# Altium schematic sheet Connectors.SchDoc: Connectors
size A3; Author: Borja Serra; CompanyName: Blueye Robotics; Organization: Blueye Robotics AS; Address1: Transittgata 10; Address2: 7042 Trondheim; Address3: Norway; Revision: 0; SheetNumber: 3; SheetTotal: 3
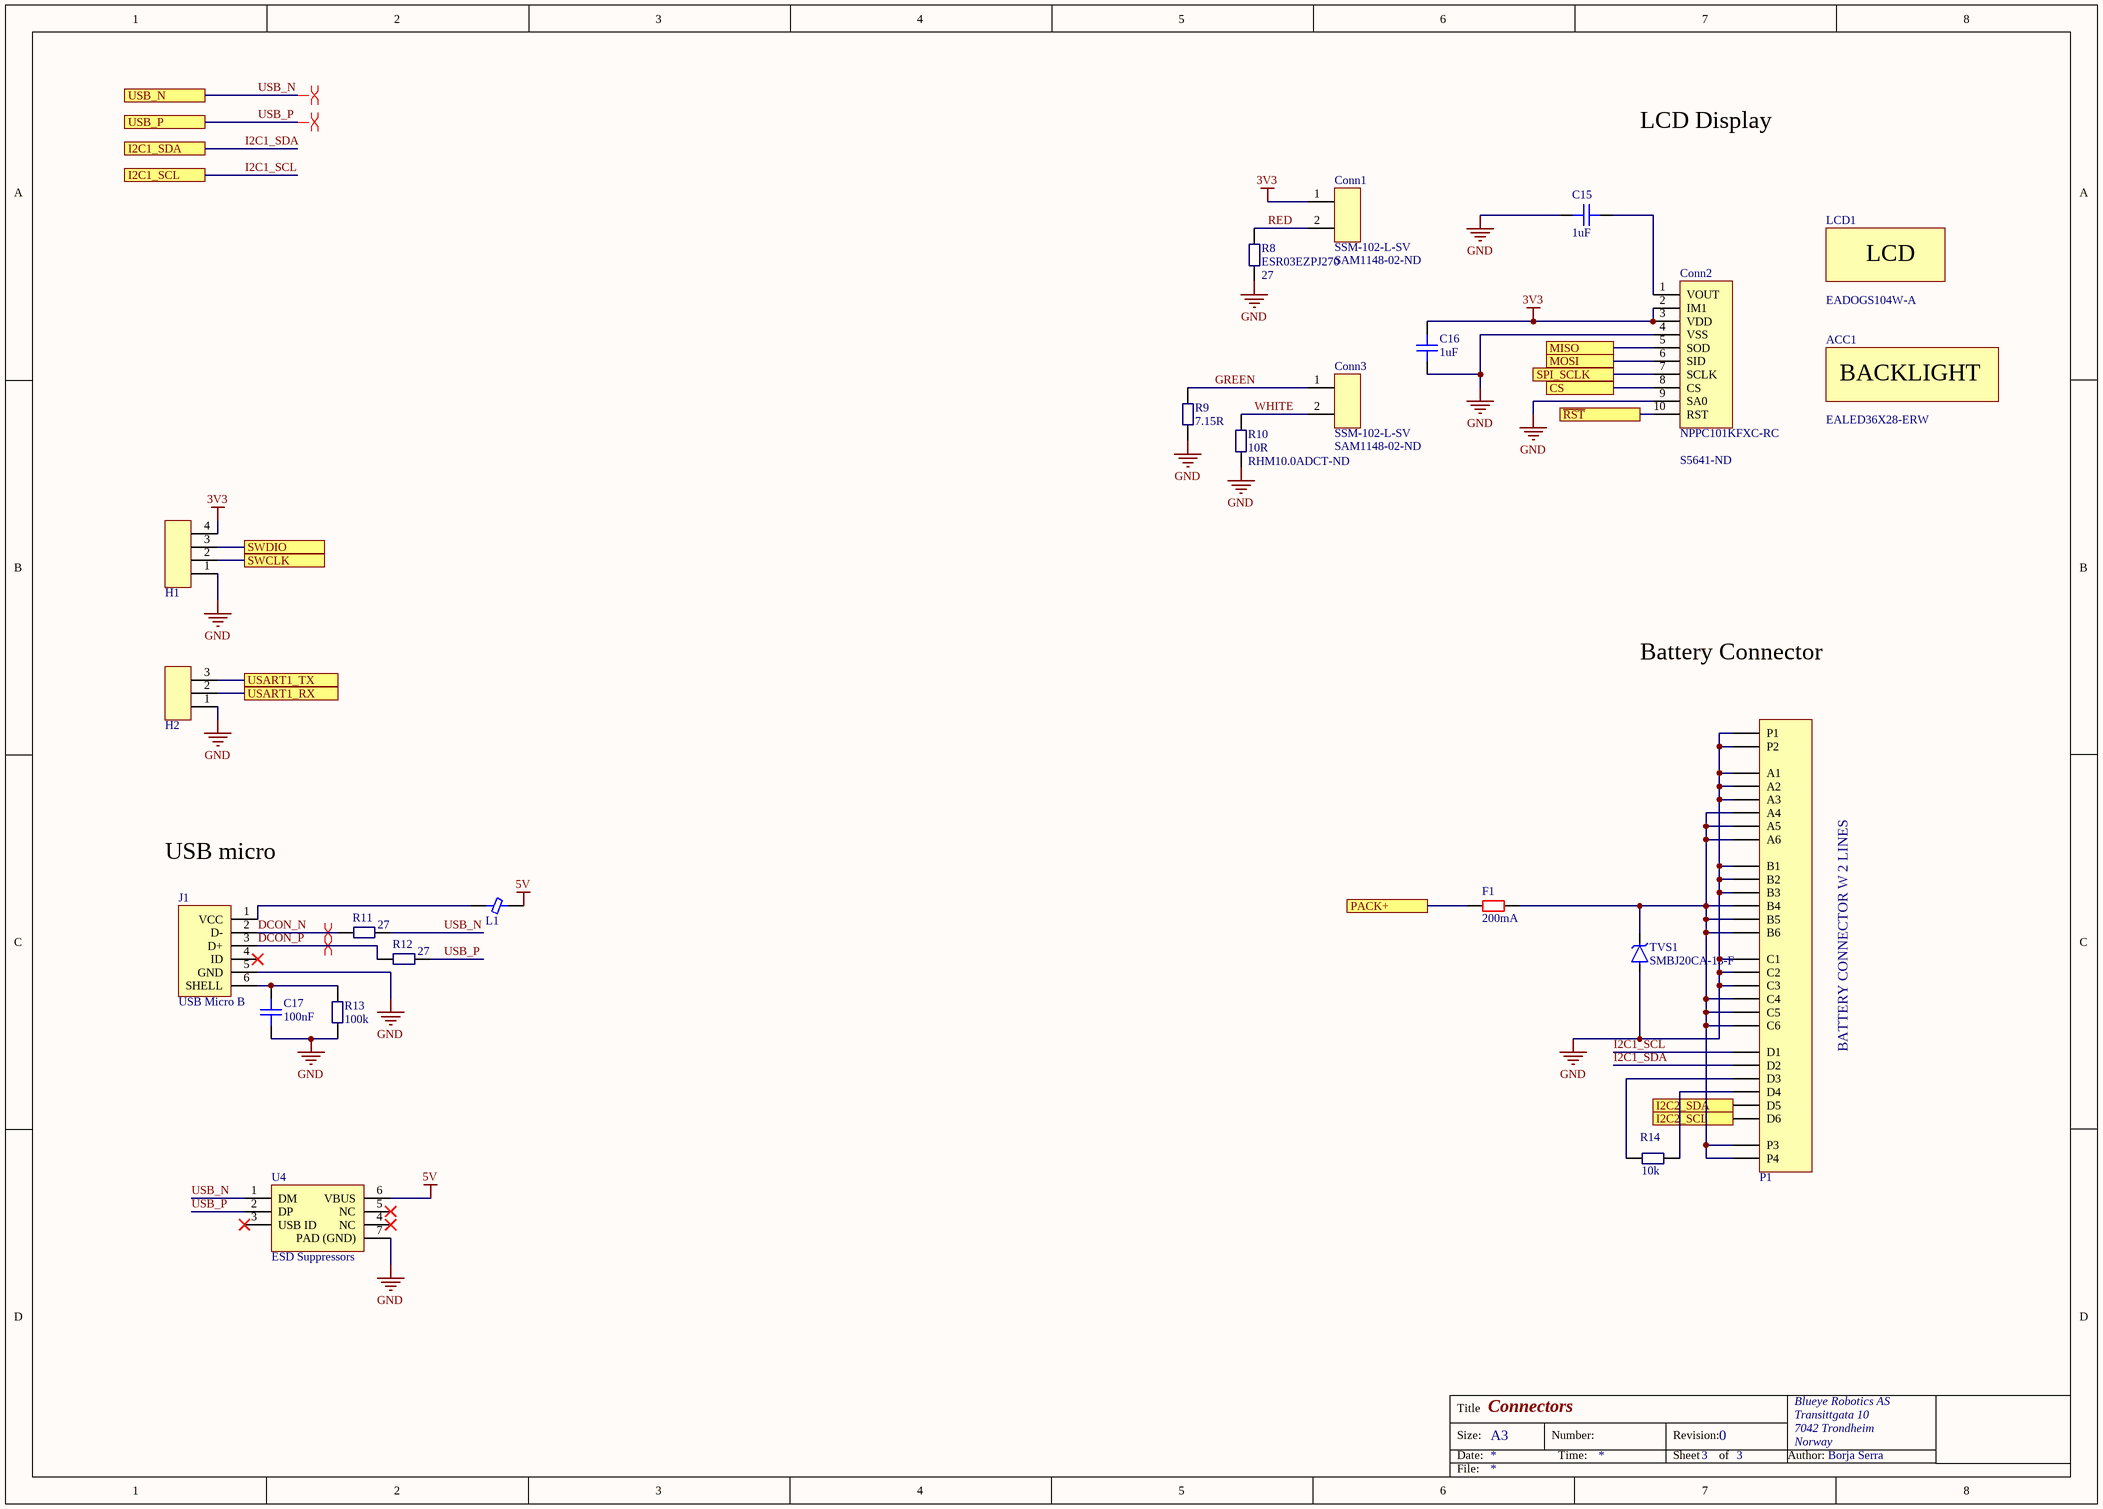
[diagram p0: Connectors.SchDoc]

## Parts
ACC1  Manufacturer Part Number 1: EALED36X28-ERW  (graphical)
C15  1uF  [1206 CAPACITOR]
C16  1uF  [1206 CAPACITOR]
C17  100nF  [0603 Capacitor]  (no BOM)
Conn1  SSM-102-L-SV  Supplier Part Number 1: SAM1148-02-ND  [CON2_1X2_DU_SSM]
Conn2  NPPC101KFXC-RC  Supplier Part Number 1: S5641-ND  [CONN FMALE 10POS .1" SMD GOLD]
Conn3  SSM-102-L-SV  Supplier Part Number 1: SAM1148-02-ND  [CON2_1X2_DU_SSM]
F1  200mA  [0603 Resistor]
H1  Header 4pin SMD  [Header 4pos 100 mil SMD]  (value not drawn)
H2  Header 3pin SMD  [Header 3pos 100 mil SMD]  (value not drawn)
J1  USB Micro B  [10118193-0001LF Micro USB]
L1  60 OHM  [0805 Capacitor]  (value not drawn)
LCD1  Manufacturer Part Number 1: EADOGS104W-A  (graphical)
P1  MPTC-02-24-02-6.30-XX-X-V-LC  [MPTC-02-24-02-6.30-XX-X-V-LC]  (value not drawn)
R8  ESR03EZPJ270  value 27  [0603 Resistor]
R9  Resistance: 7.15R  [0603 Resistor]  (hidden comment: CRCW06037R15FKEA)
R10  10R  Supplier Part Number 1: RHM10.0ADCT-ND  [0603 Resistor]
R11  value 27  [0603 Resistor]  (hidden comment: ESR03EZPJ270)
R12  value 27  [0603 Resistor]  (hidden comment: ESR03EZPJ270)
R13  100k  [0603 Resistor]  (no BOM)
R14  10k  [0603 Resistor]
TVS1  SMBJ20CA-13-F  [TVS diode]
U4  ESD Suppressors  [RCLAMP0854P.TCT - SON50P160X65_HS-7N]

## Ports
CS, I2C1_SCL, I2C1_SDA, I2C2_SCL, I2C2_SDA, MISO, MOSI, PACK+, SPI_SCLK, SWCLK, SWDIO, USART1_RX, USART1_TX, USB_N, USB_P, ~{RST}

## Nets
3V3: C16.1 Conn1.1 Conn2.2(IM1) Conn2.3(VDD) H1.4
5V: L1.2(L2) U4.6(VBUS)
GND: C15.2 C16.2 C17.1 Conn2.4(VSS) Conn2.9(SA0) H1.1 H2.1 J1.5(GND) P1.A1 P1.A2 P1.A3 P1.B1 P1.B2 P1.B3 P1.C1 P1.C2 P1.C3 P1.P1 P1.P2 R8.1 R9.1 R10.1 R13.1 TVS1.2 U4.7(PAD_(GND))
CS: Conn2.8(CS) ; port CS
DCON_N: J1.2(D-) R11.1
DCON_P: J1.3(D+) R12.1
GREEN: Conn3.1 R9.2
I2C1_SCL: P1.D1 ; port I2C1_SCL
I2C1_SDA: P1.D2 ; port I2C1_SDA
I2C2_SCL: P1.D6 ; port I2C2_SCL
I2C2_SDA: P1.D5 ; port I2C2_SDA
MISO: Conn2.5(SOD) ; port MISO
MOSI: Conn2.6(SID) ; port MOSI
PACK+: F1.1 ; port PACK+
~{RST}: Conn2.10(RST) ; port ~{RST}
RED: Conn1.2 R8.2
SPI_SCLK: Conn2.7(SCLK) ; port SPI_SCLK
SWCLK: H1.2 ; port SWCLK
SWDIO: H1.3 ; port SWDIO
USART1_RX: H2.2 ; port USART1_RX
USART1_TX: H2.3 ; port USART1_TX
USB_N: R11.2 U4.1(DM) ; port USB_N
USB_P: R12.2 U4.2(DP) ; port USB_P
WHITE: Conn3.2 R10.2
NetC15_1: C15.1 Conn2.1(VOUT)
NetC17_2: C17.2 J1.6(SHELL) R13.2
NetF1_2: F1.2 P1.A4 P1.A5 P1.A6 P1.B4 P1.B5 P1.B6 P1.C4 P1.C5 P1.C6 P1.P3 P1.P4 TVS1.1
NetJ1_1: J1.1(VCC) L1.1(L1)
NetP1_D3: P1.D3 R14.1
NetP1_D4: P1.D4 R14.2

Not connected (* = marked no-connect by the designer): J1 4(ID)*; U4 3(USB_ID)* 4(NC)* 5(NC)*

## Layout directives
differential pair: DCON_N, DCON_P, USB_N, USB_P

## Notes on the sheet
- LCD Display
- Battery Connector
- (near J1) USB micro
- BATTERY CONNECTOR W 2 LINES
- Title
- Size:
- Date:
- A3
- Number:
- Time:
- Revision:
- Sheet
- of
- Author:
- File:
- (in symbol 4X10 DOG CHARACTERDISPLAY) LCD
- (in symbol LED BACKLIT F. EA DOGS104) BACKLIGHT

## Library data of the parts
ACC1 = LED BACKLIT F. EA DOGS104: Manufacturer 1: Electronic Assembly; Supplier 1: Digi-Key; Stock 1: 9; Pricing 1: 1=14.66, 10=14.04, 25=10.92, 100=9.36, 250=8.892, 500=8.424, 1000=7.956 (USD); ComponentLink1URL: http://www.mouser.com/ds/2/127/dogs104e-553061.pdf; ComponentLink1Description: http://www.mouser.com/ds/2/127/dogs104e-553061.pdf; Supplier Part Number 1: 1481-1235-ND
C15 C16 = Capacitor 1uF 50V: Multilayer Ceramic Capacitors MLCC - SMD/SMT 1206 1.0uF 50V X7R 20%; Manufacturer: TDK; MPN: C3216X7R1H105M160AB; SPN: 810-C3216X7R1H105M; Supplier: Mouser
C17 = CAP CER 0.1UF 50V X7R 0603: MPN: CL10B104KB8NNNC; Manufacturer: Samsung Electro-Mechanics; value: 100nF; Supplier 1: Digi-Key; Supplier Part Number 1: 1276-1000-1-ND
Conn1 Conn3 = CONN RCPT .100" 2POS SNGL VERT: Manufacturer 1: Samtec; Description 1: SAMTEC         SSM-102-L-SV             Board-To-Board Connector, Vertical, SSM Series, 2 Contacts, Receptacle, 2.54 mm, Surface Mount; Contact Resistance: 10mR; Max Current Rating: 6.9A; Number of Positions: 2; Gender: Receptacle; Connector Type: Receptacle,Socket; Pitch: 2.54mm; Max Voltage Rating (AC): 475V; MPN: SSM-102-L-SV; Supplier 1: Digi-Key; Manufacturer Part Number 1: SSM-102-L-SV; Stock 1: 339; Pricing 1: 1=2.18, 10=1.953, 100=1.6081, 500=1.2711, 1000=1.0912, 5000=0.9955, 10000=0.9572 (USD); Mount: Surface Mount; Colour: Black; Housing Colour: Black; Housing Material: Polymer; Contact Plating: Nickel,Gold; Contact Material: Bronze; Min Operating Temperature: -55°C; Max Operating Temperature: 125°C; Number of Rows: 1; Packaging: Bulk; Termination: Solder; Number of Contacts: 2; Orientation: Straight; Length: 5.08mm; Depth: 2.54mm; Radiation Hardening: No; ComponentLink1URL: https://datasheet.ciiva.com/25617/0900766b811594ab-25617394.pdf; ComponentLink1Description: https://datasheet.ciiva.com/25617/0900766b811594ab-25617394.pdf; ComponentLink2URL: https://datasheet.ciiva.com/746/ssm-1xx-xxx-xx-xx-xx-x-xx-xx-mkt-746741.pdf; ComponentLink2Description: https://datasheet.ciiva.com/746/ssm-1xx-xxx-xx-xx-xx-x-xx-xx-mkt-746741.pdf; ComponentLink3URL: https://datasheet.ciiva.com/22677/81944-22677814.pdf; ComponentLink3Description: https://datasheet.ciiva.com/22677/81944-22677814.pdf; Current Rating: 6.9A; Voltage Rating: 475V; Voltage Rating (AC): 475V; Lead Pitch: 2.54mm; Lead Free: Lead Free; REACH SVHC: No SVHC
Conn2 = CONN FMALE 10POS .1" SMD GOLD: Manufacturer 1: Sullins; Pitch: 0.1inch; Number of Positions: 10; Connector Type: Socket,Header; MPN: NPPC101KFXC-RC; Manufacturer: NPPC101KFXC-RC; Supplier 1: Digi-Key; Manufacturer Part Number 1: NPPC101KFXC-RC; Stock 1: 1156; Pricing 1: 1=1.32, 10=1.195, 100=1.0244, 500=0.8537, 1000=0.7317, 5000=0.7046 (USD); Contact Plating: Gold; Contact Material: Bronze; Housing Colour: Black; Housing Material: Nylon; Number of Rows: 1; Packaging: Bulk; Termination: Solder; Length: 25.4mm; Lead Free: Lead Free; ComponentLink1URL: https://datasheet.ciiva.com/745/npxcxx1kfxx-rc10487-d-745368.pdf; ComponentLink1Description: https://datasheet.ciiva.com/745/npxcxx1kfxx-rc10487-d-745368.pdf; Description 1: CONN FMALE 10POS .1" SMD GOLD; Mount: Surface Mount; Colour: Black; Package Quantity: 1; Height: 7.1mm; Width: 2.5mm
F1 = Fuse 200mA 0603: MPN: F0603G0R20FNTR; Manufacturer: AVX Corporation; SPN: 478-6874-1-ND; Supplier: Digi-Key
H1 = Header 4pin SMD: CONN HEADER 4POS VERT 2.54MM SMD; Manufacturer: Molex, LLC; MPN: 0878980426; SPN: WM8617-ND; Supplier: Digikey
H2 = Header 3pin SMD: 3 Positions Header, Breakaway Connector 0.100" (2.54mm) Surface Mount Tin; Manufacturer: Molex, LLC; MPN: 0878980306; SPN: WM9810-ND; Supplier: Digikey
J1 = USB Micro B: USB Connectors 5P MICRO USB TYPE B RECEPTACLE W/ PEGS; Manufacturer: Amphenol FCI; MPN: 10118193-0001LF; SPN: 649-10118193-0001LF; Supplier: Mouser
L1 = FERRITE BEAD 60 ohm: FERRITE BEAD 60 OHM 0805 1LN; Manufacturer: Taiyo Yuden; MPN: BKP2125HS600-T; SPN: 587-1932-1-ND; Supplier: Digikey
LCD1 = 4X10 DOG CHARACTERDISPLAY: Manufacturer 1: Electronic Assembly; Supplier 1: Mouser; Stock 1: 0; Pricing 1: 1=16.68, 10=15.97, 50=12.42, 100=10.64, 1000=9.58, 10000=9.58 (USD); ComponentLink1URL: http://www.mouser.com/ds/2/127/dogs104e-553061.pdf; ComponentLink1Description: http://www.mouser.com/ds/2/127/dogs104e-553061.pdf; Supplier Part Number 1: 790-EADOGS104W-A
P1 = MPTC-02-24-02-6.30-XX-X-V-LC: Samtec PowerStrip 30A Signal/Power Combo Connector; MPN: MPTC-02-24-02-6.30-01-L-V; Manufacturer: Samtec
R8 R11 R12 = RES SMD 27 OHM 5% 1/4W 0603: Manufacturer 1: Rohm; Resistance: 27R; Max Power Dissipation: 250mW; Temperature Coefficient: 200ppm/°C; MPN: ESR03EZPJ270; Supplier 1: Digi-Key; Manufacturer Part Number 1: ESR03EZPJ270; Description 1: RES SMD 27 OHM 5% 1/4W 0603; Stock 1: 22229; Pricing 1: 1=0.1, 10=0.087, 100=0.0333, 1000=0.0146, 2500=0.0126 (USD); Case/Package: 0603; Case Code (Metric): 1608; Case Code (Imperial): 0603; Min Operating Temperature: -55°C; Max Operating Temperature: 155°C; Package Quantity: 5000; Packaging: Cut Tape; Tolerance: 5%; Composition: Thick Film; Number of Terminations: 2; Length: 0.063inch; Height: 0.022inch; Width: 0.031inch; ComponentLink1URL: https://datasheet.ciiva.com/14932/esr-14932374.pdf; ComponentLink1Description: https://datasheet.ciiva.com/14932/esr-14932374.pdf; ComponentLink2URL: https://datasheet.ciiva.com/14928/esr-14928807.pdf; ComponentLink2Description: https://datasheet.ciiva.com/14928/esr-14928807.pdf; Supplier Part Number 1: RHM27DCT-ND
R9 = RES SMD 7.15 OHM 1% 1/10W 0603: Manufacturer 1: Vishay Dale; Power Rating: 100mW; Voltage Rating: 75V; Temperature Coefficient: 100ppm/°C; MPN: CRCW06037R15FKEA; Supplier 1: Digi-Key; Manufacturer Part Number 1: CRCW06037R15FKEA; Description 1: RES SMD 7.15 OHM 1% 1/10W 0603; Stock 1: 21491; Pricing 1: 1=0.1, 10=0.042, 100=0.017, 1000=0.0076, 2500=0.0066 (USD); Case/Package: 0603; Weight: 7.1E-05oz; Case Code (Metric): 1608; Case Code (Imperial): 0603; Contact Plating: Tin; Min Operating Temperature: -55°C; Max Operating Temperature: 155°C; Tolerance: 1%; Packaging: Tape and Reel; Package Quantity: 5000; Composition: Thick Film; Number of Terminations: 2; Military Standard: Not; Max Power Dissipation: 100mW; Length: 1.55mm; Height: 0.02inch; Width: 0.033inch; Depth: 0.85mm; Lead Free: Lead Free; ComponentLink1URL: https://datasheet.ciiva.com/2466/dcrcwe3-2466755.pdf; ComponentLink1Description: https://datasheet.ciiva.com/2466/dcrcwe3-2466755.pdf; ComponentLink2URL: https://datasheet.ciiva.com/2466/dcrcwe3-2466756.pdf; ComponentLink2Description: https://datasheet.ciiva.com/2466/dcrcwe3-2466756.pdf; ComponentLink3URL: https://datasheet.ciiva.com/2466/dcrcwe3-2466757.pdf; ComponentLink3Description: https://datasheet.ciiva.com/2466/dcrcwe3-2466757.pdf; ComponentLink4URL: https://datasheet.ciiva.com/5562/dcrcwe3-109170-5562726.pdf; ComponentLink4Description: https://datasheet.ciiva.com/5562/dcrcwe3-109170-5562726.pdf; Supplier Part Number 1: 541-7.15HHCT-ND
R10 = RES SMD 10 OHM 5% 1/4W 0603: Manufacturer: Rohm Semiconductor; MPN: ESR03EZPF10R0; Manufacturer 1: Rohm; Description 1: RES 10 OHM 1/4W 1% 0603 SMD; Tolerance: 1%; Temperature Coefficient: 100ppm/°C; Value: 10R; SPN: RHM10.0ADCT-ND; Supplier: DigiKey; Supplier 1: Digi-Key; Manufacturer Part Number 1: ESR03EZPF10R0; Stock 1: 261792; Pricing 1: 1=0.14, 10=0.126, 100=0.0484, 1000=0.0213, 2500=0.0184 (USD); Case/Package: 0603; Min Operating Temperature: -55°C; Max Operating Temperature: 155°C; Resistance: 10R; Length: 1.6mm; Height: 0.45mm; Width: 0.8mm; Lead Free: Lead Free; ComponentLink1URL: http://www.rohm.com/web/global/datasheet/ESR01MZPF/esr-e; ComponentLink1Description: http://www.rohm.com/web/global/datasheet/ESR01MZPF/esr-e
R13 = RES SMD 100K OHM 5% 1/10W 0603: Manufacturer: Yageo; MPN: RC0603JR-07100KL; Supplier Part Number 1: 311-100KGRCT-ND; Supplier 1: Digi-Key; Value: 100k
R14 = RES SMD 10K OHM 5% 1/10W 0603: Manufacturer: Yageo; MPN: RC0603JR-0710KL; Value: 10k; Supplier Part Number 1: 311-10KGRCT-ND; Supplier 1: Digi-Key
TVS1 = TVS 20V: TVS DIODE 20VWM 32.4VC SMA; Manufacturer: Diodes Incorporated; SPN: SMBJ20CA-FDICT-ND; Supplier: Digikey; MPN: SMBJ20CA-13-F
U4 = ESD Suppressors: ESD Suppressors RCLAMP0854P 4LINES 8V SLP; Manufacturer: Semtech; MPN: RCLAMP0854P.TCT; SPN: 947-RCLAMP0854P.TCT; Supplier: Mouser